# Altium schematic sheet STM32F103VE.SchDoc
size A4
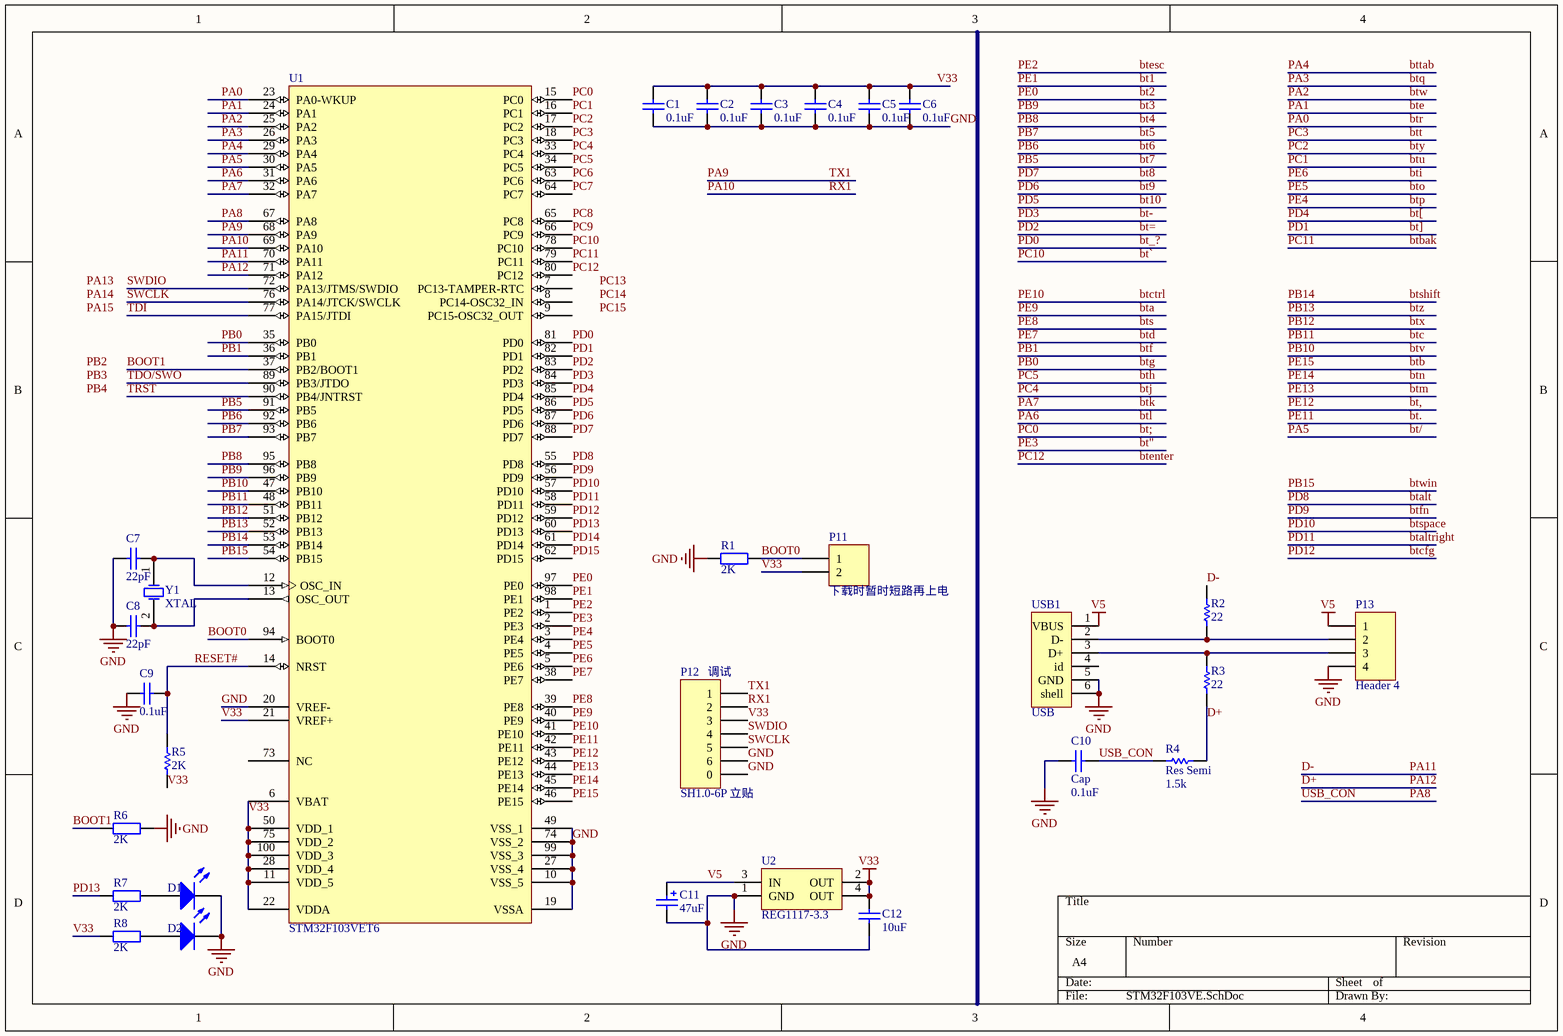
[diagram p0: STM32F103VE.SchDoc]

## Parts
C1  value 0.1uF  [CAP0805(2512)]  (hidden comment: Cap)
C2  value 0.1uF  [CAP0805(2512)]  (hidden comment: Cap)
C3  value 0.1uF  [CAP0805(2512)]  (hidden comment: Cap)
C4  value 0.1uF  [CAP0805(2512)]  (hidden comment: Cap)
C5  value 0.1uF  [CAP0805(2512)]  (hidden comment: Cap)
C6  value 0.1uF  [CAP0805(2512)]  (hidden comment: Cap)
C7  value 22pF  [CAP0805(2512)]  (hidden comment: Cap)
C8  value 22pF  [CAP0805(2512)]  (hidden comment: Cap)
C9  value 0.1uF  [CAP0805(2512)]  (hidden comment: Cap)
C10  Cap  value 0.1uF  [CAP0805(2512)]
C11  value 47uF  [CAP0805(2512)]  (hidden comment: Cap Pol2)
C12  value 10uF  [CAP0805(2512)]  (hidden comment: Cap)
D1  LED0  [DIODE_100mil]  (value not drawn)
D2  LED0  [DIODE_100mil]  (value not drawn)
P11  下载时暂时短路再上电  [HDR1X2]
P12  SH1.0-6P 立贴  [SH1.0-6P立]
P13  Header 4  [HDR1X4]
R1  value 2K  [RES0805(2012M)]  (hidden comment: Res2)
R2  value 22  [RES0805(2012M)]  (hidden comment: Res Semi)
R3  value 22  [RES0805(2012M)]  (hidden comment: Res Semi)
R4  Res Semi  value 1.5k  [RES0805(2012M)]
R5  value 2K  [RES0805(2012M)]  (hidden comment: Res Semi)
R6  value 2K  [RES0805(2012M)]  (hidden comment: Res2)
R7  value 2K  [RES0805(2012M)]  (hidden comment: Res2)
R8  value 2K  [RES0805(2012M)]  (hidden comment: Res2)
U1  STM32F103VET6  [LQFP-100]
U2  REG1117-3.3  [ZZ311]
USB1  USB  [MICRO-USB]
Y1  XTAL  [XTAL_0.4]

## Nets
GND: C1.1 C2.1 C3.1 C4.1 C5.1 C6.1 C7.1 C8.1 C9.2 C10.2 C11.2 C12.1 D1.2(K) D2.2(K) P12.0 P12.6 P13.4 R1.2 R6.1 U1.10(VSS_5) U1.19(VSSA) U1.20(VREF-) U1.27(VSS_4) U1.49(VSS_1) U1.74(VSS_2) U1.99(VSS_3) U2.1(GND) USB1.5(GND) USB1.6(shell)
V5: C11.1 P13.1 U2.3(IN) USB1.1(VBUS)
V33: C1.2 C2.2 C3.2 C4.2 C5.2 C6.2 C12.2 P11.2 P12.3 R5.1 R8.1 U1.6(VBAT) U1.11(VDD_5) U1.21(VREF+) U1.22(VDDA) U1.28(VDD_4) U1.50(VDD_1) U1.75(VDD_2) U1.100(VDD_3) U2.2(OUT) U2.4(OUT)
BOOT0: P11.1 R1.1 U1.94(BOOT0)
BOOT1: R6.2 U1.37(PB2/BOOT1)
bt1: U1.98(PE1)  [also labelled PE1]
bt2: U1.97(PE0)  [also labelled PE0]
bt3: U1.96(PB9)  [also labelled PB9]
bt4: U1.95(PB8)  [also labelled PB8]
bt5: U1.93(PB7)  [also labelled PB7]
bt6: U1.92(PB6)  [also labelled PB6]
bt7: U1.91(PB5)  [also labelled PB5]
bt8: U1.88(PD7)  [also labelled PD7]
bt9: U1.87(PD6)  [also labelled PD6]
bt10: U1.86(PD5)  [also labelled PD5]
bt": U1.2(PE3)  [also labelled PE3]
bt,: U1.43(PE12)  [also labelled PE12]
bt-: U1.84(PD3)  [also labelled PD3]
bt.: U1.42(PE11)  [also labelled PE11]
bt/: U1.30(PA5)  [also labelled PA5]
bt;: U1.15(PC0)  [also labelled PC0]
bt=: U1.83(PD2)  [also labelled PD2]
bt[: U1.85(PD4)  [also labelled PD4]
bt]: U1.82(PD1)  [also labelled PD1]
bt_?: U1.81(PD0)  [also labelled PD0]
bt`: U1.78(PC10)  [also labelled PC10]
bta: U1.40(PE9)  [also labelled PE9]
btalt: U1.55(PD8)  [also labelled PD8]
btaltright: U1.58(PD11)  [also labelled PD11]
btb: U1.46(PE15)  [also labelled PE15]
btbak: U1.79(PC11)  [also labelled PC11]
btc: U1.48(PB11)  [also labelled PB11]
btcfg: U1.59(PD12)  [also labelled PD12]
btctrl: U1.41(PE10)  [also labelled PE10]
btd: U1.38(PE7)  [also labelled PE7]
bte: U1.24(PA1)  [also labelled PA1]
btenter: U1.80(PC12)  [also labelled PC12]
btesc: U1.1(PE2)  [also labelled PE2]
btf: U1.36(PB1)  [also labelled PB1]
btfn: U1.56(PD9)  [also labelled PD9]
btg: U1.35(PB0)  [also labelled PB0]
bth: U1.34(PC5)  [also labelled PC5]
bti: U1.5(PE6)  [also labelled PE6]
btj: U1.33(PC4)  [also labelled PC4]
btk: U1.32(PA7)  [also labelled PA7]
btl: U1.31(PA6)  [also labelled PA6]
btm: U1.44(PE13)  [also labelled PE13]
btn: U1.45(PE14)  [also labelled PE14]
bto: U1.4(PE5)  [also labelled PE5]
btp: U1.3(PE4)  [also labelled PE4]
btq: U1.26(PA3)  [also labelled PA3]
btr: U1.23(PA0-WKUP)  [also labelled PA0]
bts: U1.39(PE8)  [also labelled PE8]
btshift: U1.53(PB14)  [also labelled PB14]
btspace: U1.57(PD10)  [also labelled PD10]
btt: U1.18(PC3)  [also labelled PC3]
bttab: U1.29(PA4)  [also labelled PA4]
btu: U1.16(PC1)  [also labelled PC1]
btv: U1.47(PB10)  [also labelled PB10]
btw: U1.25(PA2)  [also labelled PA2]
btwin: U1.54(PB15)  [also labelled PB15]
btx: U1.51(PB12)  [also labelled PB12]
bty: U1.17(PC2)  [also labelled PC2]
btz: U1.52(PB13)  [also labelled PB13]
D+: R3.2 R4.2 U1.71(PA12)  [also labelled PA12]
D-: R2.2 U1.70(PA11)  [also labelled PA11]
PA8: C10.1 R4.1 U1.67(PA8)  [also labelled USB_CON]
PA9: P12.1 U1.68(PA9)  [also labelled TX1]
PA10: P12.2 U1.69(PA10)  [also labelled RX1]
PC6: U1.63(PC6)
PC7: U1.64(PC7)
PC8: U1.65(PC8)
PC9: U1.66(PC9)
PD13: R7.1 U1.60(PD13)
PD14: U1.61(PD14)
PD15: U1.62(PD15)
RESET#: C9.1 R5.2 U1.14(NRST)
SWCLK: P12.5 U1.76(PA14/JTCK/SWCLK)
SWDIO: P12.4 U1.72(PA13/JTMS/SWDIO)
TDI: U1.77(PA15/JTDI)
TDO/SWO: U1.89(PB3/JTDO)
TRST: U1.90(PB4/JNTRST)
NetC7_2: C7.2 U1.12(OSC_IN) Y1.1(OSC1)
NetC8_2: C8.2 U1.13(OSC_OUT) Y1.2(OSC2)
NetD1_1: D1.1(A) R7.2
NetD2_1: D2.1(A) R8.2
NetP13_2: P13.2 R2.1 USB1.2(D-)
NetP13_3: P13.3 R3.1 USB1.3(D+)

Not connected (* = marked no-connect by the designer): U1 7(PC13-TAMPER-RTC) 8(PC14-OSC32_IN) 9(PC15-OSC32_OUT) 73(NC); USB1 4(id)

## Notes on the sheet
- (near P12) 调试
- Labels drawn without touching a wire or pin: PA13, PA14, PA15, PB2, PB3, PB4, PC13, PC14, PC15

## Library data of the parts
C1-C10 C12 = Cap: Capacitor; Published: 8-Jun-2000; LatestRevisionDate: 17-Jul-2002; LatestRevisionNote: Re-released for DXP Platform.; PackageReference: RAD-0.3; Publisher: Altium Limited
C11 = Cap Pol2: Polarized Capacitor (Axial); Published: 8-Jun-2000; LatestRevisionDate: 17-Jul-2002; LatestRevisionNote: Re-released for DXP Platform.; PackageReference: POLAR0.8; Publisher: Altium Limited; PackageDescription: Polarized Capacitor; 2 Leads
D1 D2 = LED0: Typical INFRARED GaAs LED; Published: 8-Jun-2000; LatestRevisionDate: 08-Jul-2005; LatestRevisionNote: Mech Layer 1 removed.; PackageReference: LED-0; Publisher: Altium Limited
P11 = Header 2: Header, 2-Pin; LatestRevisionDate: 17-Jul-2002; LatestRevisionNote: Re-released for DXP Platform.; Publisher: Altium Limited
P12 = Header 7: Header, 7-Pin; LatestRevisionDate: 17-Jul-2002; LatestRevisionNote: Re-released for DXP Platform.; Publisher: Altium Limited
P13 = Header 4: Header, 4-Pin; LatestRevisionDate: 17-Jul-2002; LatestRevisionNote: Re-released for DXP Platform.; Publisher: Altium Limited
R1 R6-R8 = Res2: Resistor; Published: 8-Jun-2000; LatestRevisionDate: 17-Jul-2002; LatestRevisionNote: Re-released for DXP Platform.; PackageReference: AXIAL-0.4; Publisher: Altium Limited
R2-R5 = Res Semi: Semiconductor Resistor; Published: 8-Jun-2000; LatestRevisionDate: 17-Jul-2002; LatestRevisionNote: Re-released for DXP Platform.; Publisher: Altium Limited
  R2-R4: PackageReference: RES0805(2012M)
  R5: PackageReference: AXIAL-0.5
U1 = STM32F103VBT6: STM32 ARM-based 32-bit MCU with 64 Kbytes Flash, 100-pin LQFP, Industrial Temperature; Published: 30-May-2008; DatasheetVersion: rev6, Mar-2008; PackageVersion: Mar-2008; PackageReference: LQFP100; Publisher: Altium Limited; PackageDescription: 100-Pin Low-Profile Quad Flat Pack, 14 x 14 mm Body, 0.5 mm Pitch (LQFP100); ComponentLink1Description: Manufacturer Link; ComponentLink1URL: www.st.com/stm32; ComponentLink2Description: Datasheet; ComponentLink2URL: http://www.st.com/stonline/products/literature/ds/13587.pdf
U2 = REG1117-3.3: 800mA and 1A Low Dropout Positive Regulator 2.85V, 3.3V, 5V, and Adjustable; Published: 8-Jun-2000; LatestRevisionDate: 17-Jul-2002; LatestRevisionNote: Re-released for DXP Platform.; DatasheetVersion: Sep-1997; PackageVersion: revC; PackageReference: ZZ311; Publisher: Altium Limited; PackageDescription: SOT-223/SC-73; 4 Leads; Body 6.7 x 7.3 mm, inc. leads (LxW max); ComponentLink1Description: Manufacturer Link; ComponentLink1URL: http://www.ti.com/; ComponentLink2Description: Datasheet; ComponentLink2URL: http://www-s.ti.com/sc/ds/REG1117.pdf
Y1 = XTAL: Crystal Oscillator; Published: 8-Jun-2000; LatestRevisionDate: 17-Jul-2002; LatestRevisionNote: Re-released for DXP Platform.; PackageReference: R38; Publisher: Altium Limited